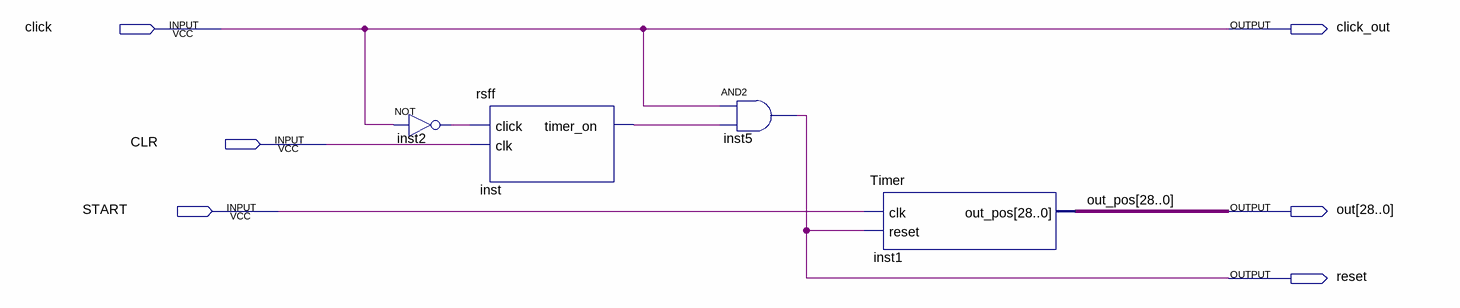
[diagram p0: schematic sheet]
// Quartus schematic Timer_with_click.bdf as structural Verilog: 4 symbols, 6 pins
module Timer_with_click (
  input  click,
  input  CLR,
  input  START,
  output click_out,
  output [28:0] out,
  output reset
);

  wire inst2_out, inst_timer_on;

  not inst2 (inst2_out, click);
  rsff inst (.click(inst2_out), .clk(CLR), .timer_on(inst_timer_on));
  and inst5 (reset, click, inst_timer_on);
  Timer inst1 (.clk(START), .reset(reset), .out_pos(out));

  assign click_out = click;

  // Other names for the same wires on the sheet: out_pos[28:0] = out
endmodule
